# Altium schematic sheet Sheet_1 V2.0_2023-09-05.schdoc
size 306 x 210 mm
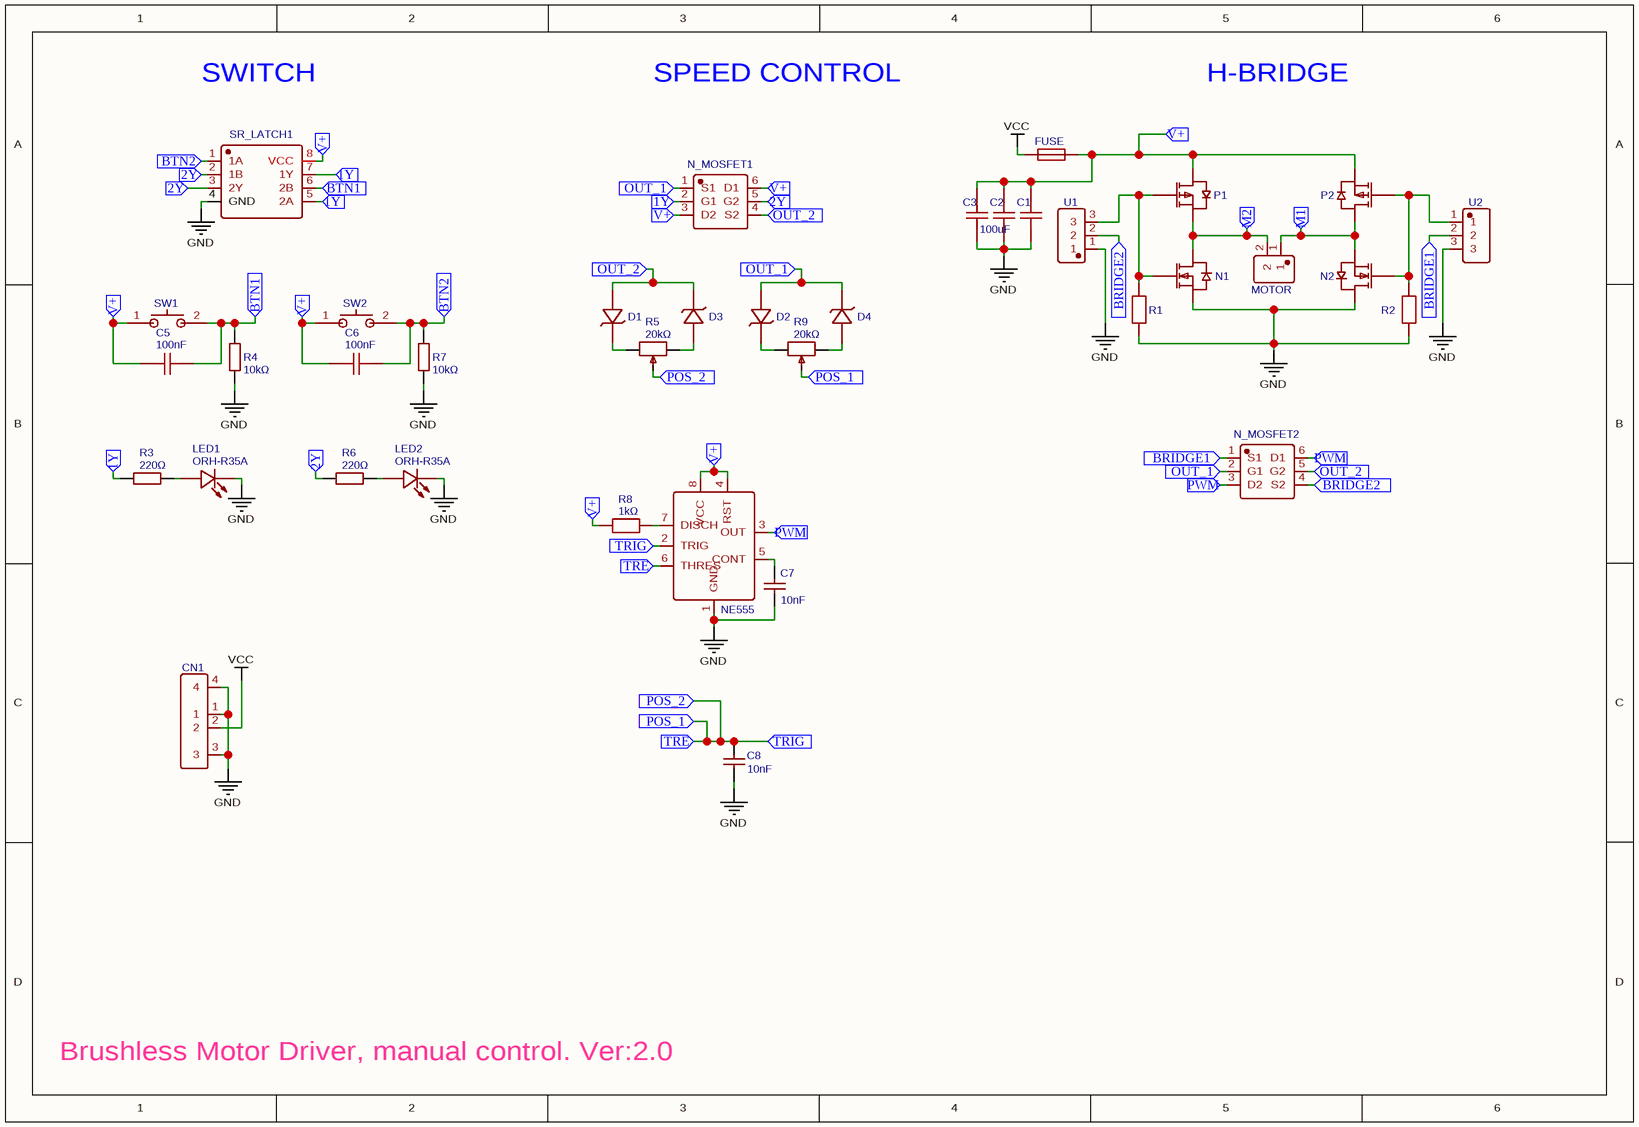
[diagram p0: Sheet_1 V2.0_2023-09-05.schdoc]

## Parts
C1  100uF  [C1206]  (value not drawn)
C2  100uF  [C1206]
C3  100uF  [C1206]  (value not drawn)
C5  100nF  [C0603]
C6  100nF  [C0603]
C7  10nF  [C1206]
C8  10nF  [C1206]
CN1  SM02B-SRSS-TB (LF)(SN)  [CONN-SMD_2P-P1.00_SM02B-SRSS-TB-LF-SN]  (value not drawn)
D1  1N4007_C727082  [SOD-123FL_L2.7-W1.8-LS3.8-RD]  (value not drawn)
D2  1N4007_C727082  [SOD-123FL_L2.7-W1.8-LS3.8-RD]  (value not drawn)
D3  1N4007_C727082  [SOD-123FL_L2.7-W1.8-LS3.8-RD]  (value not drawn)
D4  1N4007_C727082  [SOD-123FL_L2.7-W1.8-LS3.8-RD]  (value not drawn)
FUSE  MF-MSMF110/16-2  [F1812]  (value not drawn)
LED1  ORH-R35A  [LED0805-R-RD]
LED2  ORH-R35A  [LED0805-R-RD]
MOTOR  XH2.54-LI-2P_C2922484  [CONN-TH_XH2.54-2P]  (value not drawn)
N1  CJ2302 S2  [SOT-23-3_L3.0-W1.7-P0.95-LS2.9-BR]  (value not drawn)
N2  CJ2302 S2  [SOT-23-3_L3.0-W1.7-P0.95-LS2.9-BR]  (value not drawn)
N_MOSFET1  2N7002DWH6327XTSA1  [SOT-363_L2.0-W1.3-P0.65-LS2.1-BR]  (value not drawn)
N_MOSFET2  2N7002DWH6327XTSA1  [SOT-363_L2.0-W1.3-P0.65-LS2.1-BR]  (value not drawn)
NE555  100kHz  [SOIC-8_L4.9-W3.9-P1.27-LS6.0-BL]  (value not drawn)
P1  CJ2301 S1  [SOT-23-3_L3.0-W1.7-P0.95-LS2.9-BR]  (value not drawn)
P2  CJ2301 S1  [SOT-23-3_L3.0-W1.7-P0.95-LS2.9-BR]  (value not drawn)
R1  1kΩ  [R1206]  (value not drawn)
R2  1kΩ  [R1206]  (value not drawn)
R3  220Ω  [R0603]
R4  10kΩ  [R0603]
R5  20kΩ  [RES-ADJ-SMD_3P-L3.8-W3.0-P2.00-BL-FS]
R6  220Ω  [R0603]
R7  10kΩ  [R0603]
R8  1kΩ  [R1206]
R9  20kΩ  [RES-ADJ-SMD_3P-L3.8-W3.0-P2.00-BL-FS]
SR_LATCH1  SN74LVC2G02DCUR  [VSSOP-8_L2.3-W2.0-P0.50-LS3.1-BR]  (value not drawn)
SW1  GT-TC029B-H025-L1N  [SW-SMD_L3.9-W3.0-P4.45]  (value not drawn)
SW2  GT-TC029B-H025-L1N  [SW-SMD_L3.9-W3.0-P4.45]  (value not drawn)
U1  DS1021-1X3SF11-B  [HDR-TH_3P-P2.54-V-M]  (value not drawn)
U2  DS1021-1X3SF11-B  [HDR-TH_3P-P2.54-V-M]  (value not drawn)

## Ports
1Y (in), 2Y (in), BRIDGE1 (in), BRIDGE2 (in), BTN1 (in), BTN2 (in), M1 (in), M2 (in), OUT_1 (in), OUT_2 (in), POS_1 (in), POS_2 (in), PWM (in), TRE (in), TRIG (in), V+ (in)

## Nets
GND: C1.1 C2.1 C3.1 C7.1 C8.1 CN1.1 CN1.3 CN1.4 LED1.2(C) LED2.2(C) N1.2(S) N2.3(D) NE555.1(GND) R1.1 R2.1 R4.1 R7.1 SR_LATCH1.4(GND) U1.1 U2.3
VCC: CN1.2 FUSE.1
1Y: N_MOSFET1.2(G1) R3.1 SR_LATCH1.5(2A) SR_LATCH1.7(1Y) ; port 1Y
2Y: N_MOSFET1.5(G2) R6.1 SR_LATCH1.2(1B) SR_LATCH1.3(2Y) ; port 2Y
BRIDGE1: N_MOSFET2.1(S1) U2.2 ; port BRIDGE1
BRIDGE2: N_MOSFET2.4(S2) U1.2 ; port BRIDGE2
BTN1: C5.1 R4.2 SR_LATCH1.6(2B) SW1.2 ; port BTN1
BTN2: C6.1 R7.2 SR_LATCH1.1(1A) SW2.2 ; port BTN2
M1: MOTOR.1 N2.2(S) P2.3(D) ; port M1
M2: MOTOR.2 N1.3(D) P1.2(S) ; port M2
OUT_1: D2.2(A) D4.1(K) N_MOSFET1.1(S1) N_MOSFET2.2(G1) ; port OUT_1
OUT_2: D1.2(A) D3.1(K) N_MOSFET1.4(S2) N_MOSFET2.5(G2) ; port OUT_2
POS_1: C8.2 NE555.2(TRIG) NE555.6(THRES) R5.2 R9.2 ; port TRIG, port TRE, port POS_2, port POS_1
PWM: N_MOSFET2.3(D2) N_MOSFET2.6(D1) NE555.3(OUT) ; port PWM
V+: C1.2 C2.2 C3.2 C5.2 C6.2 FUSE.2 N_MOSFET1.3(D2) N_MOSFET1.6(D1) NE555.4(RST) NE555.8(VCC) P1.3(D) P2.2(S) R8.1 SR_LATCH1.8(VCC) SW1.1 SW2.1 ; port V+
NetC7_2: C7.2 NE555.5(CONT)
NetD1_1: D1.1(K) R5.3
NetD2_1: D2.1(K) R9.3
NetD3_2: D3.2(A) R5.1
NetD4_2: D4.2(A) R9.1
NetLED1_1: LED1.1(A) R3.2
NetLED2_1: LED2.1(A) R6.2
NetN1_1: N1.1(G) P1.1(G) R1.2 U1.3
NetN2_1: N2.1(G) P2.1(G) R2.2 U2.1
NetNE555_7: NE555.7(DISCH) R8.2

## Notes on the sheet
- SWITCH
- SPEED CONTROL
- H-BRIDGE
- Brushless Motor Driver, manual control. Ver:2.0

## Library data of the parts
C1-C3 = 100uF: Manufacturer: muRata(村田); Manufacturer Part: GRM31CR61A107MEA8L; nameAlias: Value; Contributor: lcsc; Supplier: LCSC; Supplier Part: C883598; JLCPCB Part Class: Extended Part; link: https://lcsc.com/eda_search?q=C883598&%26type=1&ref=editor; spicePre: C; spiceSymbolName: GRM31CR61A107MEA8L
C5 C6 = 100nF: Manufacturer: SAMSUNG(三星); Manufacturer Part: CL10B104KB8NNNC; nameAlias: Value; Supplier: LCSC; Supplier Part: C1591; JLCPCB Part Class: Extended Part; link: https://lcsc.com/eda_search?q=C1591&%26type=1&ref=editor; spicePre: C; spiceSymbolName: CL10B104KB8NNNC
C7 C8 = 10nF: Manufacturer: FH(风华); Manufacturer Part: 1206B103K102NT; nameAlias: Value; Supplier: LCSC; Supplier Part: C9194; JLCPCB Part Class: Extended Part; link: https://lcsc.com/eda_search?q=C9194&%26type=1&ref=editor; spicePre: C; spiceSymbolName: 1206B103K102NT
CN1 = SM02B-SRSS-TB (LF)(SN): Manufacturer: JST; Contributor: LCSC; Supplier: LCSC; Supplier Part: C160402; Manufacturer Part: SM02B-SRSS-TB(LF)(SN); JLCPCB Part Class: Extended Part; link: https://lcsc.com/eda_search?q=C160402&%26type=1&ref=editor; spicePre: C; spiceSymbolName: SM02B-SRSS-TB (LF)(SN)
D1-D4 = 1N4007_C727082: Manufacturer: TWGMC(台湾迪嘉); Manufacturer Part: 1N4007; Contributor: LCSC; JLCPCB Part Class: Extended Part; Supplier: LCSC; Supplier Part: C727082; link: https://lcsc.com/eda_search?q=C727082&%26type=1&ref=editor; spicePre: D; spiceSymbolName: 1N4007_C727082
FUSE = MF-MSMF110/16-2: Manufacturer: BOURNS; Contributor: LCSC; Supplier: LCSC; Supplier Part: C210834; Manufacturer Part: MF-MSMF110/16-2; JLCPCB Part Class: Extended Part; link: https://lcsc.com/eda_search?q=C210834&%26type=1&ref=editor; spicePre: F; spiceSymbolName: MF-MSMF110/16-2
LED1 LED2 = ORH-R35A: Manufacturer: Orient(奥伦德); Contributor: LCSC; Supplier: LCSC; Supplier Part: C205444; Manufacturer Part: ORH-R35A; JLCPCB Part Class: Extended Part; link: https://lcsc.com/eda_search?q=C205444&%26type=1&ref=editor; spicePre: L; spiceSymbolName: ORH-R35A
MOTOR = XH2.54-LI-2P_C2922484: Manufacturer: null; Contributor: LCSC; Supplier: LCSC; Supplier Part: C2922484; Manufacturer Part: XH2.54-LI-2P; JLCPCB Part Class: Extended Part; link: https://lcsc.com/eda_search?q=C2922484&%26type=1&ref=editor; spicePre: U; spiceSymbolName: XH2.54-LI-2P_C2922484
N1 N2 = CJ2302 S2: Manufacturer: CJ(江苏长电/长晶); Supplier: LCSC; Manufacturer Part: CJ2302 S2; Supplier Part: C8548; JLCPCB Part Class: Extended Part; link: https://lcsc.com/eda_search?q=C8548&%26type=1&ref=editor; spicePre: Q; spiceSymbolName: CJ2302 S2
N_MOSFET1 N_MOSFET2 = 2N7002DWH6327XTSA1: Manufacturer: Infineon(英飞凌); Contributor: LCSC; Supplier: LCSC; Manufacturer Part: 2N7002DWH6327; Supplier Part: C151535; JLCPCB Part Class: Extended Part; link: https://lcsc.com/eda_search?q=C151535&%26type=1&ref=editor; spicePre: Q; spiceSymbolName: 2N7002DWH6327XTSA1
NE555 = 100kHz: Manufacturer: TI(德州仪器); Manufacturer Part: NE555DR; nameAlias: Value; spicePre: X; Supplier: LCSC; Supplier Part: C7593; JLCPCB Part Class: Basic Part; link: https://lcsc.com/eda_search?q=C7593&%26type=1&ref=editor; spiceSymbolName: NE555DR
P1 P2 = CJ2301 S1: Manufacturer: CJ(江苏长电/长晶); Supplier: LCSC; Manufacturer Part: CJ2301 S1; Supplier Part: C8547; JLCPCB Part Class: Extended Part; link: https://lcsc.com/eda_search?q=C8547&%26type=1&ref=editor; spicePre: Q; spiceSymbolName: CJ2301 S1
R1 R2 R8 = 1kΩ: Manufacturer: Viking(光颉); Manufacturer Part: CR-06JA7----1K; nameAlias: Value; Contributor: LCSC; Supplier: LCSC; Supplier Part: C408770; JLCPCB Part Class: Extended Part; link: https://lcsc.com/eda_search?q=C408770&%26type=1&ref=editor; spicePre: R; spiceSymbolName: CR-06JA7----1K
R3 R6 = 220Ω: Manufacturer: YAGEO(国巨); Manufacturer Part: RC0603FR-07220RL; nameAlias: Value; Supplier: LCSC; Supplier Part: C107696; JLCPCB Part Class: Extended Part; link: https://lcsc.com/eda_search?q=C107696&%26type=1&ref=editor; spicePre: R; spiceSymbolName: RC0603FR-07220RL
R4 R7 = 10kΩ: Manufacturer: UNI-ROYAL(厚声); Manufacturer Part: 0603WAF1002T5E; nameAlias: Value; Supplier: LCSC; Supplier Part: C25804; JLCPCB Part Class: Basic Part; link: https://lcsc.com/eda_search?q=C25804&%26type=1&ref=editor; spicePre: R; spiceSymbolName: 0603WAF1002T5E
R5 R9 = 20kΩ: Manufacturer: HDK(北陆电气); Manufacturer Part: VG039NCHXTB203; nameAlias: Value; Resistance(Ohms): 20K; Supplier: LCSC; Supplier Part: C128550; JLCPCB Part Class: Extended Part; link: https://lcsc.com/eda_search?q=C128550&%26type=1&ref=editor; spicePre: R; spiceSymbolName: VG039NCHXTB203
SR_LATCH1 = SN74LVC2G02DCUR: Manufacturer: TI(德州仪器); Supplier: LCSC; Manufacturer Part: SN74LVC2G02DCUR; Supplier Part: C133589; JLCPCB Part Class: Extended Part; link: https://lcsc.com/eda_search?q=C133589&%26type=1&ref=editor; spicePre: U; spiceSymbolName: SN74LVC2G02DCUR
SW1 SW2 = GT-TC029B-H025-L1N: Manufacturer: G-Switch(品赞); Contributor: LCSC; Supplier: LCSC; Supplier Part: C843669; Manufacturer Part: GT-TC029B-H025-L1N; JLCPCB Part Class: Extended Part; link: https://lcsc.com/eda_search?q=C843669&%26type=1&ref=editor; spicePre: S; spiceSymbolName: GT-TC029B-H025-L1N
U1 U2 = DS1021-1X3SF11-B: Manufacturer: CONNFLY; Contributor: lcsc; Supplier: LCSC; Supplier Part: C7430359; Manufacturer Part: DS1021-1x3SF11-B; link: https://lcsc.com/eda_search?q=C7430359&%26type=1&ref=editor; spicePre: U; spiceSymbolName: DS1021-1X3SF11-B